# Altium project IEPE_INTERFACE.PrjPcb
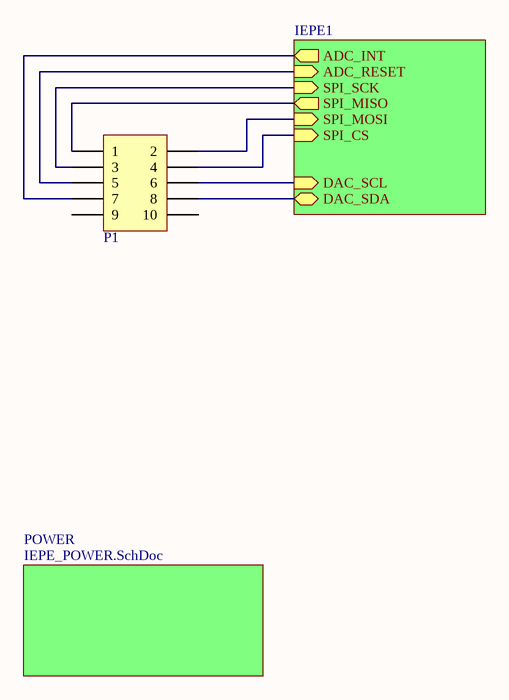
[diagram p0: TOP.SchDoc]
Version: 1.0
3 sheets, 87 parts. Net scope: hierarchical (ports join the sheet entries above them; power ports are global).
Board file: IEPE_PCB.PcbDoc
Sheets:
  TOP.SchDoc
    IEPE1 = IEPE.SchDoc
    POWER = IEPE_POWER.SchDoc

## Sheet TOP.SchDoc
size A4; SheetNumber: 1; SheetTotal: 7

### Parts
P1  Box Header  [BoxHDR-2x5]  (value not drawn)

### Sub-sheets
IEPE1 = IEPE.SchDoc: ADC_RESET (in), ADC_INT (out), DAC_SCL (in), DAC_SDA (bidir), SPI_SCK (in), SPI_MISO (out), SPI_MOSI (in), SPI_CS (in)
POWER = IEPE_POWER.SchDoc: no entries

### Nets
ADC_RESET: P1.5 ; sheet IEPE1/ADC_RESET
SCL: P1.6 ; sheet IEPE1/DAC_SCL
SDA: P1.8 ; sheet IEPE1/DAC_SDA
SPI_CS: P1.4 ; sheet IEPE1/SPI_CS
SPI_INT: P1.7 ; sheet IEPE1/ADC_INT
SPI_MISO: P1.1 ; sheet IEPE1/SPI_MISO
SPI_MOSI: P1.2 ; sheet IEPE1/SPI_MOSI
SPI_SCK: P1.3 ; sheet IEPE1/SPI_SCK

Not connected (* = marked no-connect by the designer): P1 9 10

### Library data of the parts
P1 = BoxHdr-2x5

## Sheet IEPE.SchDoc
size A3; SheetNumber: 5; SheetTotal: 7
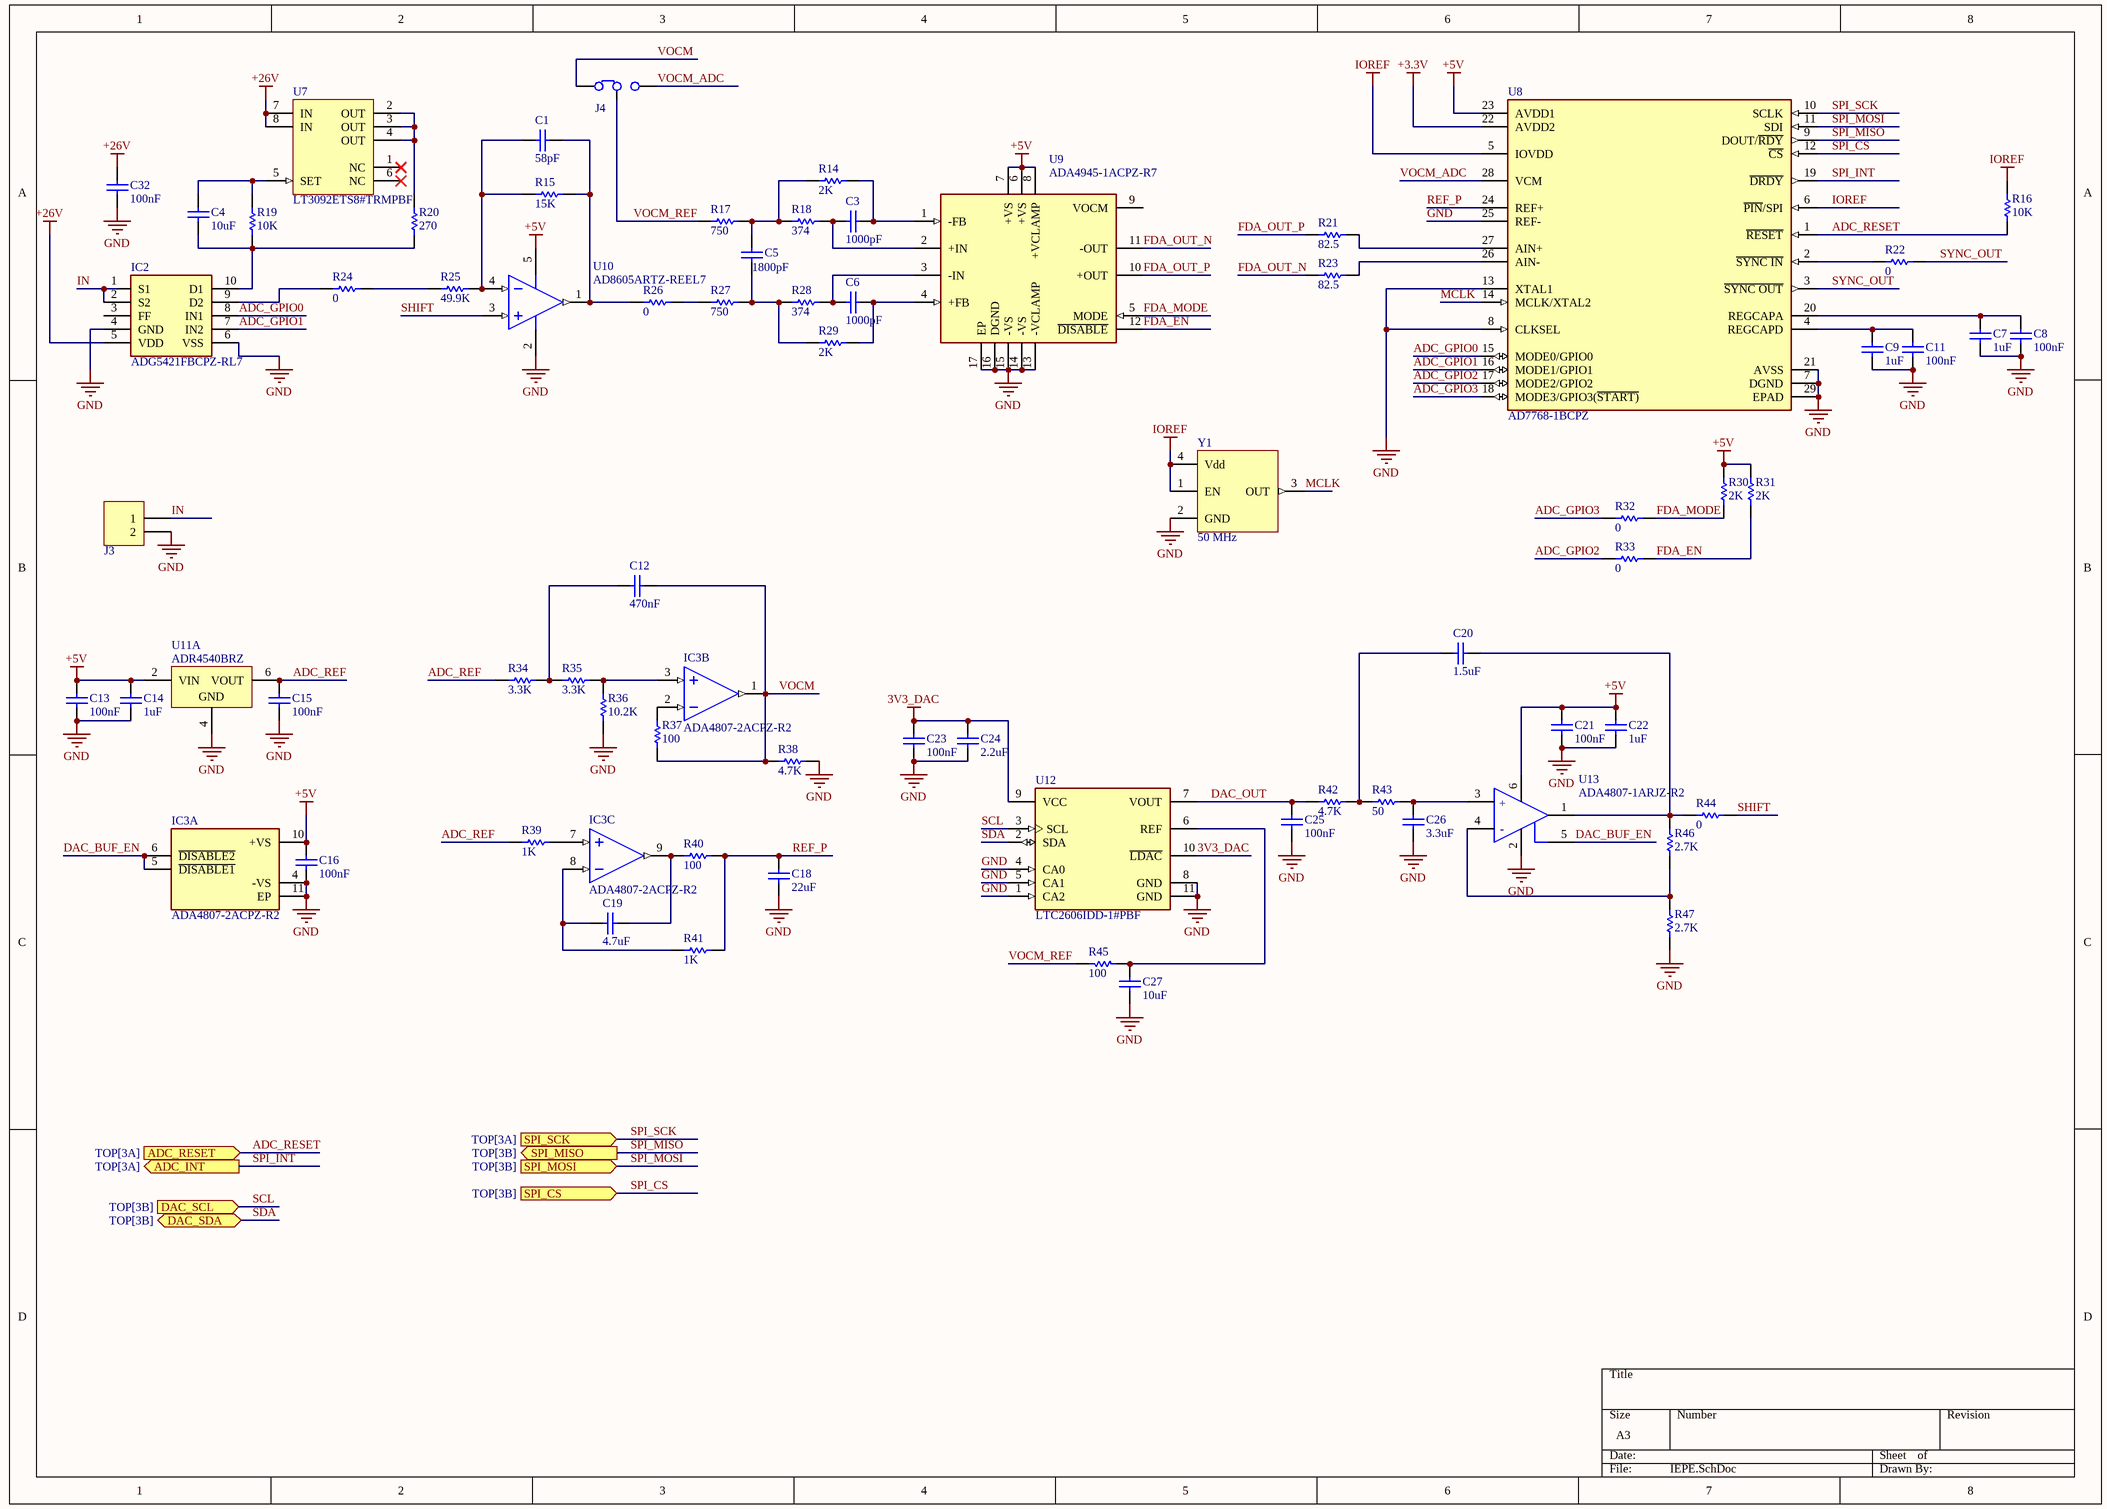
[diagram p1: IEPE.SchDoc]

### Parts
C1  58pF  [C603]
C3  1000pF  [C603]
C4  10uF  [C805]
C5  1800pF  [C603]
C6  1000pF  [C603]
C7  1uF  [C603]
C8  100nF  [C603]
C9  1uF  [C603]
C11  100nF  [C603]
C12  470nF  [C603]
C13  100nF  [C603]
C14  1uF  [C603]
C15  100nF  [C603]
C16  100nF  [C603]
C18  22uF  [C603]
C19  4.7uF  [C603]
C20  1.5uF  [C603]
C21  100nF  [C603]
C22  1uF  [C603]
C23  100nF  [C603]
C24  2.2uF  [C603]
C25  100nF  [C603]
C26  3.3uF  [C603]
C27  10uF  [C603]
C32  100nF  [C603]
IC2  ADG5421FBCPZ-RL7  [SON50P200X300X80-10N-D]
IC3  ADA4807-2ACPZ-R2  [SON50P300X300X80-11N-D]  (parts A,B,C of 3)
J3  CONN-2  [SMB-ANT]  (value not drawn)
J4  jumper  [jumper-3-SMD]  (value not drawn)
R14  2K  [R0603]
R15  15K  [R0603]
R16  10K  [R0603]
R17  750  [R0603]
R18  374  [R0603]
R19  10K  [R0603]
R20  270  [R0603]
R21  82.5  [R0603]
R22  0  [R0603]
R23  82.5  [R0603]
R24  0  [R0603]
R25  49.9K  [R0603]
R26  0  [R0603]
R27  750  [R0603]
R28  374  [R0603]
R29  2K  [R0603]
R30  2K  [R0603]
R31  2K  [R0603]
R32  0  [R0603]
R33  0  [R0603]
R34  3.3K  [R0603]
R35  3.3K  [R0603]
R36  10.2K  [R0603]
R37  100  [R0603]
R38  4.7K  [R0603]
R39  1K  [R0603]
R40  100  [R0603]
R41  1K  [R0603]
R42  4.7K  [R0603]
R43  50  [R0603]
R44  0  [R0603]
R45  100  [R0603]
R46  2.7K  [R0603]
R47  2.7K  [R0603]
U7  LT3092ETS8#TRMPBF  [SOT65P280X100-8N]
U8  AD7768-1BCPZ  [FP-CP-28-12-IPC_C]
U9  ADA4945-1ACPZ-R7  [FP-CP-16-22-IPC_C]
U10  AD8605ARTZ-REEL7  [SOT95P280X145-5N]
U11  ADR4540BRZ  [SOIC-8N]  (part A of 2)
U12  LTC2606IDD-1#PBF  [FP-DD-10-05-08-1699-IPC_C]
U13  ADA4807-1ARJZ-R2  [FP-RJ-6-IPC_A]
Y1  50 MHz  [OSC3225]

### Ports
ADC_INT (out, see TOP[3A]), ADC_RESET (in, see TOP[3A]), DAC_SCL (in, see TOP[3B]), DAC_SDA (bidir, see TOP[3B]), SPI_CS (in, see TOP[3B]), SPI_MISO (out, see TOP[3B]), SPI_MOSI (in, see TOP[3B]), SPI_SCK (in, see TOP[3A])

### Nets
3V3_DAC: C23.1 C24.1 U12.9(VCC) U12.10(~{LDAC})
+3.3V: U8.22(AVDD2)
+5V: C13.1 C14.1 C16.1 C21.1 C22.1 IC3.10(+VS) R30.1 R31.1 U8.23(AVDD1) U9.6(+VS) U9.7(+VS) U9.8(+VCLAMP) U10.5(+V) U11.2(VIN) U13.6(+VS)
+26V: C32.1 IC2.5(VDD) U7.7(IN) U7.8(IN)
GND: C7.2 C8.2 C9.2 C11.2 C13.2 C14.2 C15.2 C16.2 C18.2 C21.2 C22.2 C23.2 C24.2 C25.2 C26.2 C27.2 C32.2 IC2.4(GND) IC2.6(VSS) IC3.4(-VS) IC3.11(EP) J3.2 R36.2 R38.2 R47.1 U8.7(DGND) U8.8(CLKSEL) U8.13(XTAL1) U8.21(AVSS) U8.25(REF-) U8.29(EPAD) U9.13(-VCLAMP) U9.14(-VS) U9.15(-VS) U9.16(DGND) U9.17(EP) U10.2(-V) U11.4(GND) U12.1(CA2) U12.4(CA0) U12.5(CA1) U12.8(GND) U12.11(GND) U13.2(-VS) Y1.2(GND)
IOREF: R16.1 U8.5(IOVDD) U8.6(~{PIN}/SPI) Y1.1(EN) Y1.4(Vdd)
ADC_GPIO0: IC2.8(IN1) U8.15(MODE0/GPIO0)
ADC_GPIO1: IC2.7(IN2) U8.16(MODE1/GPIO1)
ADC_GPIO2: R33.2 U8.17(MODE2/GPIO2)
ADC_GPIO3: R32.2 U8.18(MODE3/GPIO3(~{START)})
ADC_REF: C15.1 R34.2 R39.1 U11.6(VOUT)
ADC_RESET: R16.2 U8.1(~{RESET}) ; port ADC_RESET
DAC_BUF_EN: IC3.5(~{DISABLE1}) IC3.6(~{DISABLE2}) U13.5(~{DISABLE})
DAC_OUT: C25.1 R42.1 U12.7(VOUT)
FDA_EN: R31.2 R33.1 U9.12(~{DISABLE})
FDA_MODE: R30.2 R32.1 U9.5(MODE)
FDA_OUT_N: R23.2 U9.11(-OUT)
FDA_OUT_P: R21.2 U9.10(+OUT)
IN: IC2.1(S1) IC2.2(S2) J3.1
MCLK: U8.14(MCLK/XTAL2) Y1.3(OUT)
REF_P: C18.1 R40.2 R41.2 U8.24(REF+)
SCL: U12.3(SCL) ; port DAC_SCL
SDA: U12.2(SDA) ; port DAC_SDA
SHIFT: R44.2 U10.3(+IN)
SPI_CS: U8.12(~{CS}) ; port SPI_CS
SPI_INT: U8.19(~{DRDY}) ; port ADC_INT
SPI_MISO: U8.9(DOUT/~{RDY}) ; port SPI_MISO
SPI_MOSI: U8.11(SDI) ; port SPI_MOSI
SPI_SCK: U8.10(SCLK) ; port SPI_SCK
SYNC_OUT: R22.1 U8.3(~{SYNC_OUT})
VOCM: C12.1 IC3.1(VOUT) J4.1(C1) R37.2 R38.1
VOCM_ADC: J4.3(C3) U8.28(VCM)
VOCM_REF: J4.2(C2) R17.2 R45.2
NetC1_1: C1.1 R15.1 R26.2 U10.1(OUT)
NetC1_2: C1.2 R15.2 R25.1 U10.4(-IN)
NetC3_1: C3.1 R18.1 U9.2(+IN)
NetC3_2: C3.2 R14.1 U9.1(-FB)
NetC4_1: C4.1 IC2.10(D1) R19.1 R20.1
NetC4_2: C4.2 R19.2 U7.5(SET)
NetC5_1: C5.1 R14.2 R17.1 R18.2
NetC5_2: C5.2 R27.1 R28.2 R29.2
NetC6_1: C6.1 R28.1 U9.3(-IN)
NetC6_2: C6.2 R29.1 U9.4(+FB)
NetC7_1: C7.1 C8.1 U8.20(REGCAPA)
NetC9_1: C9.1 C11.1 U8.4(REGCAPD)
NetC12_2: C12.2 R34.1 R35.2
NetC19_1: C19.1 IC3.9(VOUT2) R40.1
NetC19_2: C19.2 IC3.8(-IN2) R41.1
NetC20_1: C20.1 R42.2 R43.1
NetC20_2: C20.2 R44.1 R46.2 U13.1(VOUT)
NetC26_1: C26.1 R43.2 U13.3(+IN)
NetC27_1: C27.1 R45.1 U12.6(REF)
NetIC2_9: IC2.9(D2) R24.2
NetIC3_2: IC3.2(-IN1) R37.1
NetIC3_3: IC3.3(+IN1) R35.1 R36.1
NetIC3_7: IC3.7(+IN2) R39.2
NetR20_2: R20.2 U7.2(OUT) U7.3(OUT) U7.4(OUT)
NetR21_1: R21.1 U8.27(AIN+)
NetR22_2: R22.2 U8.2(~{SYNC_IN})
NetR23_1: R23.1 U8.26(AIN-)
NetR24_1: R24.1 R25.2
NetR26_1: R26.1 R27.2
NetR46_1: R46.1 R47.2 U13.4(-IN)

Not connected (* = marked no-connect by the designer): IC2 3(FF); U7 1(NC)* 6(NC)*; U9 9(VOCM)

### Notes on the sheet
- (in symbol CMP-09116-000179-1) +; -

### Library data of the parts
C1 C3-C9 C11-C16 C18-C27 C32 = Cap: Capacitor; Designer: Parsa Malekpour
  C1: Value: 58pF
  C3 C6: Value: 1000pF
  C4 C27: Value: 10uF
  C5: Value: 1800pF
  C7 C9 C14 C22: Value: 1uF
  C8 C11 C13 C15 C16 C21 C23 C25 C32: Value: 100nF
  C12: Value: 470nF
  C18: Value: 22uF
  C19: Value: 4.7uF
  C20: Value: 1.5uF
  C24: Value: 2.2uF
  C26: Value: 3.3uF
IC2 = ADG5421FBCPZ-RL7: Integrated Circuit; Manufacturer_Name: Analog Devices; Datasheet Link: https://www.analog.com/ADG5421F/datasheet; Height: 0.8mm; Manufacturer_Part_Number: ADG5421FBCPZ-RL7; Mouser Part Number: 584-ADG5421FBCPZ-RL7; Mouser Price/Stock: https://www.mouser.co.uk/ProductDetail/Analog-Devices/ADG5421FBCPZ-RL7?qs=T94vaHKWudQNcGWA2Nw7gg%3D%3D; Arrow Part Number: ADG5421FBCPZ-RL7; Arrow Price/Stock: https://www.arrow.com/en/products/adg5421fbcpz-rl7/analog-devices?region=nac
IC3 = ADA4807-2ACPZ-R2: Integrated Circuit; Manufacturer_Name: Analog Devices; Datasheet Link: https://componentsearchengine.com/Datasheets/2/ADA4807-2ACPZ-R2.pdf; Height: 0.8mm; Manufacturer_Part_Number: ADA4807-2ACPZ-R2; Mouser Part Number: 584-ADA4807-2ACPZ-R2; Mouser Price/Stock: https://www.mouser.co.uk/ProductDetail/Analog-Devices/ADA4807-2ACPZ-R2?qs=xbTpb2TSnD%2FWQQylmCBTow%3D%3D; Arrow Part Number: ADA4807-2ACPZ-R2; Arrow Price/Stock: null?region=nac
J4 = Triple Jumper: Jumper wire
R14-R47 = Resistor: Designer: Parsa Malekpour
  R14 R29-R31: Value: 2K
  R15: Value: 15K
  R16 R19: Value: 10K
  R17 R27: Value: 750
  R18 R28: Value: 374
  R20: Value: 270
  R21 R23: Value: 82.5
  R22 R24 R26 R32 R33 R44: Value: 0
  R25: Value: 49.9K
  R34 R35: Value: 3.3K
  R36: Value: 10.2K
  R37 R40 R45: Value: 100
  R38 R42: Value: 4.7K
  R39 R41: Value: 1K
  R43: Value: 50
  R46 R47: Value: 2.7K
U7 = CMP-0472-00073-1: 200 mA Two-Terminal Programmable Current Source, 0.3 mA Isupply, 8-pin SOT23 (TS8-8), -40 to 125 degC, Pb-Free, Mini Tape and Reel; Manufacturer: Linear Technology; Vin Max(V): 40; Output Current Range: 0.5 mA to 200 mA; Initial Accuracy(%): 1; Extended Temp: E, I, MP; Vin Min(V): 1.2; Isupply(mA): 0.3; PackageVersion: Rev. A, 08/2010; Packing: Mini Tape and Reel; ComponentLink2Description: Datasheet; RoHS: TRUE; DatasheetVersion: Rev. B; ComponentLink3Description: Package Specification; ComponentLink1URL: http://www.linear.com/; ComponentLink2URL: http://cds.linear.com/docs/en/datasheet/3092fb.pdf; Code_JEDEC: MO-193; PackageReference: TS8-8; Mounting Technology: Surface Mount; ComponentLink1Description: Manufacturer URL; PackageDescription: 8-Pin Plastic TSOT-23, Body 2.9 x 1.63 mm, Pitch 0.65 mm; PartNumber: LT3092ETS8#TRMPBF; ComponentLink3URL: http://cds.linear.com/docs/en/packaging/SOT_8_05-08-1637.pdf
U8 = CMP-09081-000087-1: IC ADC 24BIT SIGMA-DELTA 28LFCSP; Number of A/D Converters: 1; Interface: SPI; Sampling Rate: 1024000S/s; Number of Bits: 24; RoHS Compliant: Yes; Min Operating Temperature: -40°C; Number of Pins: 28; Number of Inputs: 1; Max Operating Temperature: 125°C
U9 = ADA4945-1ACPZ-R7: IC ADC DRIVER 16LFCSP; Number of Pins: 16
U10 = CMP-0384-01494-2: Single Channel Wide Bandwidth Operational Amplifier, 10 MHz BW, 5 V/us SR, Industrial, 5-pin SOT23 (RJ-5), Reel; Manufacturer: Analog Devices; Generic Part Number: AD8605; Input Offset Voltage: 20uV; V Span Min: 2.7V; Input Bias Current: 200fA; Slew Rate: 5V/us; V Span Max: 6V; Small Signal Bandwidth: 10MHz; Amplifiers Per Package: 1; Iq/Amp: 1.2mA; ComponentLink2Description: Datasheet; PackageVersion: 121608-A; Mounting Technology: Surface Mount; ComponentLink3URL: http://www.analog.com/static/imported-files/packages/PKG_PDF/SOT-23(RJ)/RJ_5.pdf; Code_JEDEC: MO-178-AA; ComponentLink1Description: Manufacturer URL; ComponentLink4Description: Reference Circuit; RevisionNote: Reference Circuit URL fixed; PartNumber: AD8605ARTZ-REEL7; DatasheetVersion: Rev. L; PackageDescription: 5-Pin Small Outline Transistor Package, Body 2.9 x 1.6 mm, Pitch 0.95 mm; ComponentLink4URL: http://www.analog.com/en/all-operational-amplifiers-op-amps/operational-amplifiers-op-amps/ad8605/products/product.html#product-recommendations; ComponentLink3Description: Package Specification; ComponentLink1URL: http://www.analog.com/en/index.html; PackageReference: RJ-5; ComponentLink2URL: http://www.analog.com/static/imported-files/data_sheets/AD8605_8606_8608.pdf
U11 = CMP-0784-00192-1: Ultralow Noise, High Accuracy Voltage Reference, 4.096 V Output, 3 to 15 V Supply, Industrial, 8-pin SOIC (R-8), Tube; Manufacturer: Analog Devices; Max V Supply (V): 15; Min V Supply (V): 3; Vout: 4.096V; Ref Out TC (ppm/C): 2; ComponentLink4URL: Product URL:http://www.analog.com/en/special-linear-functions/voltage-references/adr4540/products/product.html; Mounting Technology: Surface Mount; ComponentLink1Description: Manufacturer URL; PackageDescription: 8-Pin Standard Small Outline Package, Body 4.9 x 3.9 mm, Pitch 1.27 mm; ComponentLink2URL: http://www.analog.com/static/imported-files/data_sheets/ADR4520_4525_4530_4533_4540_4550.pdf; ComponentLink1URL: http://www.analog.com/en/index.html; DatasheetVersion: Rev. 0; ComponentLink4Description: URL Link1; Operating Temp Range: -40 to 125 degC; PartNumber: ADR4540BRZ; ComponentLink2Description: Datasheet; ComponentLink3URL: http://www.analog.com/static/imported-files/packages/PKG_PDF/SOIC_Narrow%20(R)/R_8.pdf; ComponentLink3Description: Package Specification; PackageVersion: 060506-A, 06/2006; Packing: Tube; PackageReference: R-8; Code_JEDEC: MS-012-AA
U12 = CMP-09082-000079-1: IC DAC 16BIT V-OUT 10DFN; Max Supply Voltage: 5.5V; Number of Bits: 16; Integral Nonlinearity (INL): 64LSB; Number of Channels: 1; Supply Type: Single; Interface: I2C; Nominal Supply Current: 340uA; Settling Time: 10us; Resolution: 16b; Min Supply Voltage: 2.7V; Output Type: Voltage; Packaging: Rail/Tube; Lead Free: Lead Free; Case/Package: DFN; Max Operating Temperature: 85°C; RoHS Compliant: Yes; Mount: Surface Mount; Min Operating Temperature: -40°C; Number of Pins: 10; Package Quantity: 121; Supply Current: 340uA; REACH SVHC: No SVHC; Number of Converters: 1
U13 = CMP-09116-000179-1: IC OPAMP VFB 1 CIRCUIT SOT23-6; -3db Bandwidth: 180MHz; Max Frequency: 100kHz; Bandwidth: 200MHz; Min Supply Voltage: 3V; Max Input Voltage: 11V; Common Mode Rejection Ratio: 96dB; Power Supply Rejection Ratio (PSRR): 105dB; Output Current: 60mA; Input Offset Voltage (Vos): 20uV; Output Current per Channel: 106mA; Number of Circuits: 1; Min Input Voltage: 2.7V; Operating Supply Voltage: 10V; Input Bias Current: 1.2uA; Operating Supply Current: 950uA; Voltage Gain: 130dB; Slew Rate: 225V/µs; Dual Supply Voltage: 5V; Height: 1.3mm; Min Operating Temperature: -40°C; Mount: Surface Mount; Lead Free: Contains Lead; Gain Bandwidth Product: 200MHz; Contact Plating: Tin; Width: 1.7mm; Packaging: Cut Tape; Max Operating Temperature: 125°C; Case/Package: SOT-23-6; Number of Pins: 6; Length: 3mm; REACH SVHC: No SVHC; Max Supply Voltage: 11V; RoHS Compliant: Yes; Number of Amplifiers: 1
Y1 = OSCILLATOR: Frequency: 50 MHz

## Sheet IEPE_POWER.SchDoc
size A; SheetNumber: 7; SheetTotal: 7
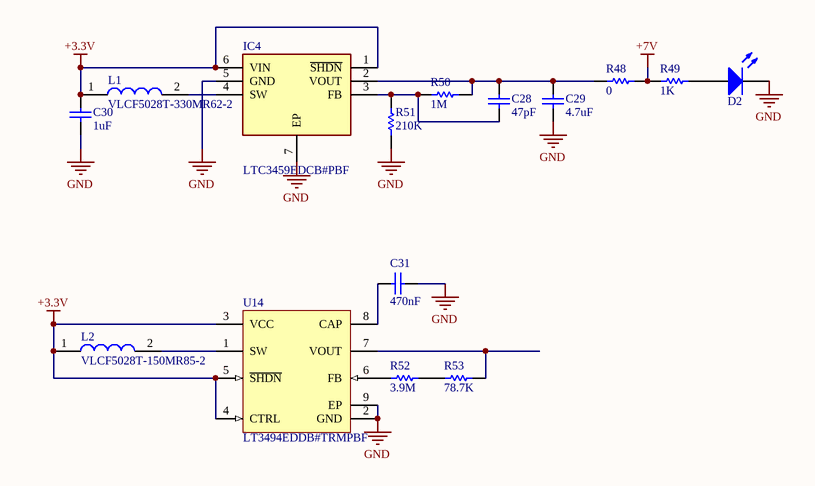
[diagram p2: IEPE_POWER.SchDoc]

### Parts
C28  47pF  [c603]
C29  4.7uF  [C805]
C30  1uF  [c603]
C31  470nF  [c603]
D2  LED  [led-0603]  (value not drawn)
IC4  LTC3459EDCB#PBF  [SON50P300X200X80-7N-D]
L1  VLCF5028T-330MR62-2  [VLCF5028]
L2  VLCF5028T-150MR85-2  [VLCF5028]
R48  0  [R0603]
R49  1K  [R0603]
R50  1M  [R0603]
R51  210K  [R0603]
R52  3.9M  [R0603]
R53  78.7K  [R0603]
U14  LT3494EDDB#TRMPBF  [LT-DDB-8_V]

### Nets
+3.3V: C30.2 IC4.1(~{SHDN}) IC4.6(VIN) L1.1 L2.1 U14.3(VCC) U14.4(CTRL) U14.5(~{SHDN})
+7V: R48.2 R49.1
GND: C29.1 C30.1 C31.1 D2.2(K) IC4.5(GND) IC4.7(EP) R51.1 U14.2(GND) U14.9(EP)
NetC28_1: C28.1 IC4.3(FB) R50.1 R51.2
NetC28_2: C28.2 C29.2 IC4.2(VOUT) R48.1 R50.2
NetC31_2: C31.2 U14.8(CAP)
NetD2_1: D2.1(A) R49.2
NetIC4_4: IC4.4(SW) L1.2
NetL2_2: L2.2 U14.1(SW)
NetR52_1: R52.1 U14.6(FB)
NetR52_2: R52.2 R53.1
NetR53_2: R53.2 U14.7(VOUT)

### Library data of the parts
C28-C31 = Cap: Capacitor; Designer: Parsa Malekpour
  C28: Value: 47pF
  C29: Value: 4.7uF
  C30: Value: 1uF
  C31: Value: 470nF
IC4 = LTC3459EDCB#PBF: Integrated Circuit; Manufacturer_Name: Analog Devices; Datasheet Link: https://eu.mouser.com/datasheet/2/609/3459fc-1268033.pdf; Height: 0.8mm; Manufacturer_Part_Number: LTC3459EDCB#PBF; Mouser Part Number: 584-LTC3459EDCB#PBF; Mouser Price/Stock: https://www.mouser.co.uk/ProductDetail/Analog-Devices/LTC3459EDCBPBF?qs=oahfZPh6IAJQ4v4AGuZiZA%3D%3D
L1 = VLCF5028T-330MR62-2: Inductor; Manufacturer_Name: TDK; Datasheet Link: https://product.tdk.com/system/files/dam/doc/product/inductor/inductor/smd/catalog/inductor_commercial_power_vlcf5028-2_en.pdf; Manufacturer_Part_Number: VLCF5028T-330MR62-2; Mouser Part Number: 810-VLCF528T330MR622; Mouser Price/Stock: https://www.mouser.co.uk/ProductDetail/TDK/VLCF5028T-330MR62-2?qs=uxmvvYJjMIsxJaGpQbGMMg%3D%3D
L2 = VLCF5028T-150MR85-2: Inductor; Manufacturer_Name: TDK; Datasheet Link: https://product.tdk.com/system/files/dam/doc/product/inductor/inductor/smd/catalog/inductor_commercial_power_vlcf5028-2_en.pdf; Manufacturer_Part_Number: VLCF5028T-150MR85-2; Mouser Part Number: 810-VLCF528T150MR852; Mouser Price/Stock: https://www.mouser.co.uk/ProductDetail/TDK/VLCF5028T-150MR85-2?qs=uxmvvYJjMIszC3VRfNbrqA%3D%3D; Arrow Part Number: VLCF5028T-150MR85-2; Arrow Price/Stock: https://www.arrow.com/en/products/vlcf5028t-150mr85-2/tdk?region=nac
R48-R53 = Resistor: Designer: Parsa Malekpour
  R48: Value: 0
  R49: Value: 1K
  R50: Value: 1M
  R51: Value: 210K
  R52: Value: 3.9M
  R53: Value: 78.7K
U14 = CMP-0491-00356-1: Micropower Low Noise Boost Converter with Output Disconnect, 8-pin SON (DDB-8), -40 to 85 degC, Pb-Free, Mini Tape and Reel; Manufacturer: Linear Technology; Number of Outputs: 1; ComponentLink1Description: Manufacturer URL; ComponentLink3URL: http://cds.linear.com/docs/en/packaging/DFN_8_05-08-1702.pdf; Code_JEDEC: MO-229; ComponentLink2URL: http://cds.linear.com/docs/en/datasheet/3494fb.pdf; PackageVersion: Rev. B, 06/2010; PackageReference: DDB-8; ComponentLink1URL: http://www.linear.com/; PartNumber: LT3494EDDB#TRMPBF; Packing: Mini Tape and Reel; PackageDescription: 8-Pin Plastic DFN, Body 3 x 2 mm, Pitch 0.5 mm; Mounting Technology: Surface Mount; RoHS: TRUE; ComponentLink3Description: Package Specification; ComponentLink2Description: Datasheet; DatasheetVersion: Rev. B

## Nets that join several sheets
+3.3V: IEPE (U8.22), IEPE_POWER (8 pins)
GND: IEPE (45 pins), IEPE_POWER (9 pins)
ADC_RESET: TOP (P1.5), IEPE (R16.2 U8.1)
SCL: TOP (P1.6), IEPE (U12.3)
SDA: TOP (P1.8), IEPE (U12.2)
SPI_CS: TOP (P1.4), IEPE (U8.12)
SPI_INT: TOP (P1.7), IEPE (U8.19)
SPI_MISO: TOP (P1.1), IEPE (U8.9)
SPI_MOSI: TOP (P1.2), IEPE (U8.11)
SPI_SCK: TOP (P1.3), IEPE (U8.10)